# Altium schematic sheet AM-Config&LCD.SchDoc
size A
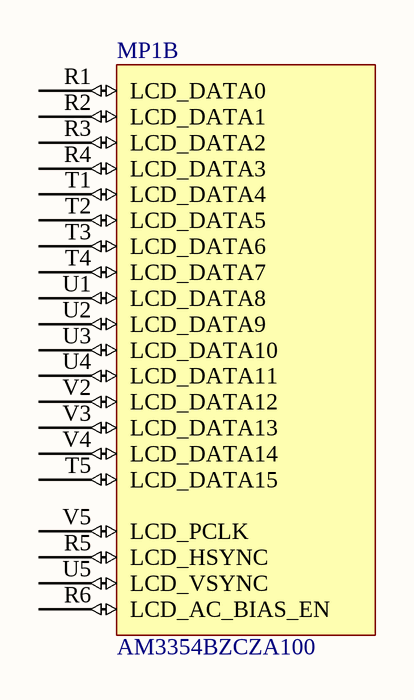
[diagram p0: AM-Config&LCD.SchDoc]

## Parts
MP1  AM3354BZCZA100  [TI-ZCZ324]  (part B of 9)

## Nets

Not connected (* = marked no-connect by the designer): MP1 R1(LCD_DATA0) R2(LCD_DATA1) R3(LCD_DATA2) R4(LCD_DATA3) R5(LCD_HSYNC) R6(LCD_AC_BIAS_EN) T1(LCD_DATA4) T2(LCD_DATA5) T3(LCD_DATA6) T4(LCD_DATA7) T5(LCD_DATA15) U1(LCD_DATA8) U2(LCD_DATA9) U3(LCD_DATA10) U4(LCD_DATA11) U5(LCD_VSYNC) V2(LCD_DATA12) V3(LCD_DATA13) V4(LCD_DATA14) V5(LCD_PCLK)

## Library data of the parts
MP1 = CMP-0547-00017-2: Sitara ARM Cortex-A8 32-Bit RISC Microprocessor, 1 GHz, SGX530 3D Graphics Engine, Programmable Real-Time Unit and Industrial Communication Subsystem (PRU-ICSS), -40 to 105 degC, 324-pin NFBGA (ZCZ), Green (RoHS & no Sb/Br); Manufacturer: Texas Instruments; eQEP: 3; CAN: 2; UART (SCI): 6; ComponentLink2Description: Datasheet; Mounting Technology: Surface Mount; ComponentLink3Description: Package Specification; Operating Temperature: -40 to 105 degC; PackageReference: ZCZ324; ComponentLink3URL: http://www.ti.com/lit/ds/symlink/am3352.pdf; ARM CPU: Cortex-A8; SPI: 2; ComponentLink2URL: http://www.ti.com/lit/ds/symlink/am3352.pdf; ComponentLink1URL: http://www.ti.com/; PackageVersion: 4211570/A; DatasheetVersion: SPRS717F; eCAP: 3; ComponentLink1Description: Manufacturer URL; PartNumber: AM3354BZCZA100; I2C: 3; PackageDescription: 324-Pin Plastic Ball Grid Array, Body 15 x 15 mm, Pitch 0.8 mm